# EasyEDA Pro project ProPrj_SHIGURE_2025-02-14.epro

# Schematic Schematic1
Board Name: Board1; Create Date: 2025-01-20; Page Name: P1; Project Name: SHIGURE; Schematic Name: Schematic1; Update Date: 2025-01-20; Company: 嘉立创EDA; Page Size: A4; Version: V1.0
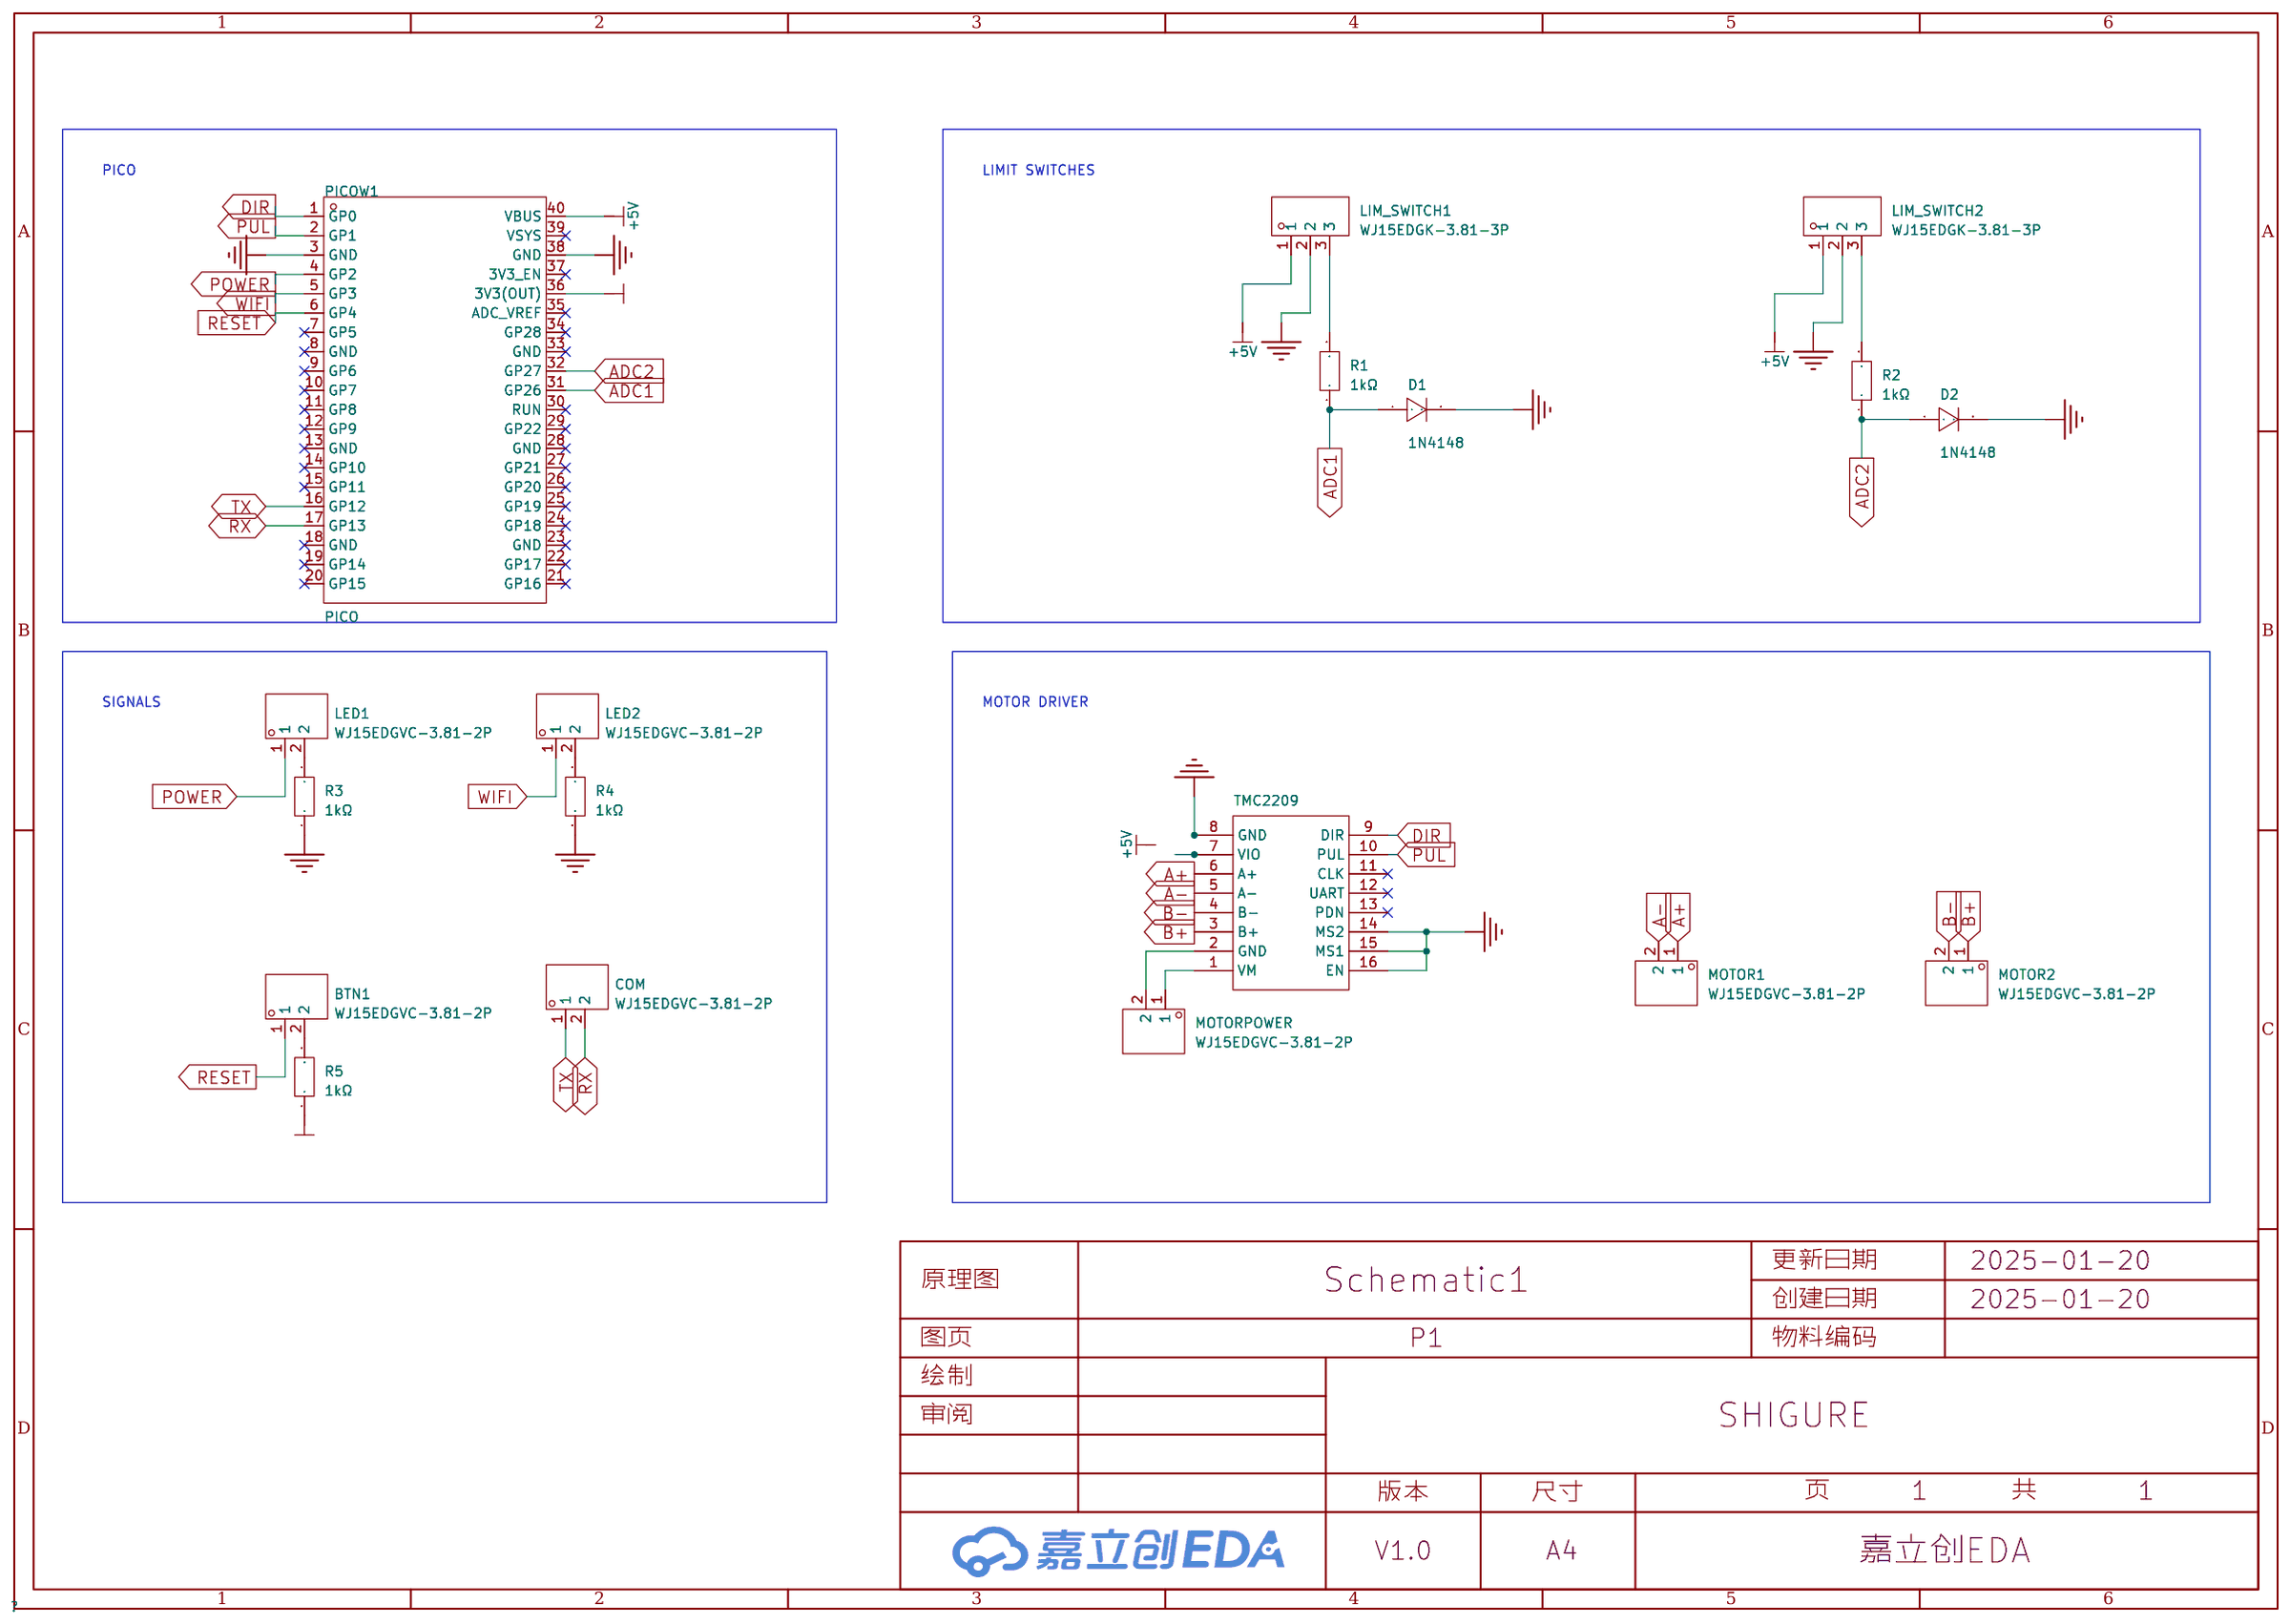
[diagram p0: schematic sheet]

## Parts
BTN1  WJ15EDGVC-3.81-2P  [CONN-TH_WJ15EDGVC-3.81-2P]
COM  WJ15EDGVC-3.81-2P  [CONN-TH_WJ15EDGVC-3.81-2P]
D1  1N4148  [DO-35_BD2.0-L4.0-P8.00-D0.5-FD]
D2  1N4148  [DO-35_BD2.0-L4.0-P8.00-D0.5-FD]
LED1  WJ15EDGVC-3.81-2P  [CONN-TH_WJ15EDGVC-3.81-2P]
LED2  WJ15EDGVC-3.81-2P  [CONN-TH_WJ15EDGVC-3.81-2P]
LIM_SWITCH1  WJ15EDGK-3.81-3P  [CONN-TH_3P-P3.81_KF2EDGV-3.81-3P]
LIM_SWITCH2  WJ15EDGK-3.81-3P  [CONN-TH_3P-P3.81_KF2EDGV-3.81-3P]
MOTOR1  WJ15EDGVC-3.81-2P  [CONN-TH_WJ15EDGVC-3.81-2P]
MOTOR2  WJ15EDGVC-3.81-2P  [CONN-TH_WJ15EDGVC-3.81-2P]
MOTORPOWER  WJ15EDGVC-3.81-2P  [CONN-TH_WJ15EDGVC-3.81-2P]
PICOW1  PICO  [PICO直插]
R1  1kΩ  [RES-TH_BD2.7-L6.2-P10.20-D0.4]
R2  1kΩ  [RES-TH_BD2.7-L6.2-P10.20-D0.4]
R3  1kΩ  [RES-TH_BD2.7-L6.2-P10.20-D0.4]
R4  1kΩ  [RES-TH_BD2.7-L6.2-P10.20-D0.4]
R5  1kΩ  [RES-TH_BD2.7-L6.2-P10.20-D0.4]
TMC2209  -  [TMC2209Module]

## Library data of the parts
BTN1 COM LED1 LED2 MOTOR1 MOTOR2 MOTORPOWER = WJ15EDGVC-3.81-2P: 连接器类型:板端/插座-闭口;固定方式:-;结构:1x2P;间距:3.81mm;颜色:-;安装方式:直针;排数:1;每排PIN数:2;额定电流:8A;额定电压:300V;线规 - AWG:-;线规 - 平方毫米:-;触头材质:黄铜;触头镀层:锡;工作温度范围:-40℃~+105℃;焊接温度(最大值):-;; LCSC Part Name: 1x2P 3.81mm 排数:1 每排P数:2; Supplier Part: C8396; Manufacturer: KANGNEX(康奈克斯电气); Supplier Footprint: 插件,P=3.81mm; JLCPCB Part Class: 扩展库; Datasheet: https://atta.szlcsc.com/upload/public/pdf/source/20191225/C8396_DFFE6D58C2AF45781C2AF0BF2B733CCC.pdf; Supplier: LCSC; Connector Type: 板端/插座-闭口; Structure: 1x2P; Pitch: 3.81mm; Mounting Style: 直针; Number of Pins: 2P; Number of Rows: 1; Number of PINs Per Row: 2; Current Rating (Max): 8A; Voltage Rating (Max): 300V; Contact Material: 黄铜; Contact Plating: 锡; Operating Temperature Range: -40℃~+105℃
D1 D2 = 1N4148_C258182: 二极管配置:-;正向压降(Vf):1V@10mA;直流反向耐压(Vr):100V;平均整流电流(Io):200mA;反向恢复时间(trr):4ns;; LCSC Part Name: 电压:100V 电流:200mA; Supplier Part: C258182; Manufacturer: onsemi(安森美); Supplier Footprint: DO-35; JLCPCB Part Class: 扩展库; Datasheet: https://atta.szlcsc.com/upload/public/pdf/source/20180829/C258182_3EE2D0AB6109C1B72B054FC50B8BC8AD.pdf; Supplier: LCSC; Forward Voltage (Vf@If): 1V@10mA; Reverse Voltage (Vr): 100V; Average Rectified Current (Io): 200mA; Reverse Leakage Current: 5uA@75V; Reverse Recovery Time (trr): 4ns; Operating Temperature: -55℃~+175℃@(Tj)
LIM_SWITCH1 LIM_SWITCH2 = WJ15EDGK-3.81-3P: 连接器类型:公插头;固定方式:-;结构:1x3P;间距:3.81mm;颜色:-;安装方式:-;排数:1;每排PIN数:3;额定电流:8A;额定电压:300V;线规 - AWG:16~28;线规 - 平方毫米:1.5;触头材质:磷青铜;触头镀层:-;工作温度范围:-40℃~+105℃;焊接温度(最大值):-;; LCSC Part Name: 1x3P 3.81mm 排数:1 每排P数:3; Supplier Part: C8413; Manufacturer: KANGNEX(康奈克斯电气); Supplier Footprint: P=3.81mm; JLCPCB Part Class: 扩展库; Datasheet: https://atta.szlcsc.com/upload/public/pdf/source/20191225/C8413_41584A983D2B58879696392C97DFEE11.pdf; Supplier: LCSC; Connector Type: 公插头; Structure: 1x3P; Pitch: 3.81mm; Number of Pins: 3P; Number of Rows: 1; Number of PINs Per Row: 3; Current Rating (Max): 8A; Voltage Rating (Max): 300V; Wire Gauge - AWG: 16~28; Wire Gauge - mm2: 1.5; Contact Material: 磷青铜; Operating Temperature Range: -40℃~+105℃; Connection Type: 螺钉连接(M2); Outlet Direction (Vertical Basis): 顶部出线
PICOW1 = PICO: "基于Raspberry Pi RP2040芯片设计；处理器：双核Arm Cortex-M0+ @ 133MHz内存：264KB片上SRAM；2MB板上QSPI闪存接口：26个GPIO引脚，包括3个模拟输入；2 × UART；2 × SPI控制器；2 × I2C控制器；16个PWM通道；1 × USB 1.1控制器和PHY，支持主机和设备；8 × PIO状态机"; Supplier Part: C7203002; Manufacturer: Raspberry Pi(树莓派); Datasheet: https://atta.szlcsc.com/upload/public/pdf/source/20230906/086376002DDC9866828648BC93E51F8B.pdf; Supplier: LCSC
R1-R5 = MF1/4W-1K±1%-ST52: 电阻类型:金属膜电阻;阻值:1kΩ;精度:±1%;功率:250mW;温度系数:±100ppm/℃;; LCSC Part Name: 金属膜电阻 1kΩ ±1% 250mW; Supplier Part: C2903245; Manufacturer: VO(翔胜); Supplier Footprint: 插件,D2.7xL6.2mm; JLCPCB Part Class: 扩展库; Datasheet: https://atta.szlcsc.com/upload/public/pdf/source/20200609/C601728_5AA4C0C8E12E11069DA2C3356F29D1F2.pdf; Supplier: LCSC; Type: 金属膜电阻; Tolerance: ±1%; Overload Voltage (Max): 250V; Power(Watts): 250mW; Temperature Coefficient: ±100ppm/℃; Operating Temperature Range: -55℃~+155℃
TMC2209 = TMC2209Module

## Nets
3V3: PICOW1.36(3V3(OUT)) R5.1
+5V: LIM_SWITCH1.1 LIM_SWITCH2.1 PICOW1.40(VBUS) TMC2209.7(VIO)
GND: D1.2(K) D2.2(K) LIM_SWITCH1.2 LIM_SWITCH2.2 PICOW1.3(GND) PICOW1.38(GND) R3.1 R4.1 TMC2209.8(GND) TMC2209.14(MS2) TMC2209.15(MS1) TMC2209.16(EN)
A+: MOTOR1.1 TMC2209.6(A+)
A-: MOTOR1.2 TMC2209.5(A-)
ADC1: D1.1(A) PICOW1.31(GP26) R1.1
ADC2: D2.1(A) PICOW1.32(GP27) R2.1
B+: MOTOR2.1 TMC2209.3(B+)
B-: MOTOR2.2 TMC2209.4(B-)
DIR: PICOW1.1(GP0) TMC2209.9(DIR)
POWER: LED1.1 PICOW1.4(GP2)
PUL: PICOW1.2(GP1) TMC2209.10(PUL)
RESET: BTN1.1 PICOW1.6(GP4)
RX: COM.2 PICOW1.17(GP13)
TX: COM.1 PICOW1.16(GP12)
WIFI: LED2.1 PICOW1.5(GP3)
$1N923: LIM_SWITCH1.3 R1.2
$1N1215: LIM_SWITCH2.3 R2.2
$1N1557: LED1.2 R3.2
$1N1596: LED2.2 R4.2
$1N2055: BTN1.2 R5.2
Net-(MOTORPOWER-1): MOTORPOWER.1 TMC2209.1(VM)
Net-(MOTORPOWER-2): MOTORPOWER.2 TMC2209.2(GND)

Not connected (* = marked no-connect by the designer): PICOW1 7(GP5)* 8(GND)* 9(GP6)* 10(GP7)* 11(GP8)* 12(GP9)* 13(GND)* 14(GP10)* 15(GP11)* 18(GND)* 19(GP14)* 20(GP15)* 21(GP16)* 22(GP17)* 23(GND)* 24(GP18)* 25(GP19)* 26(GP20)* 27(GP21)* 28(GND)* 29(GP22)* 30(RUN)* 33(GND)* 34(GP28)* 35(ADC_VREF)* 37(3V3_EN)* 39(VSYS)*; TMC2209 11(CLK)* 12(UART)* 13(PDN)*

## Notes on the sheet
- PICO
- LIMIT SWITCHES
- SIGNALS
- MOTOR DRIVER

# Board PCB1
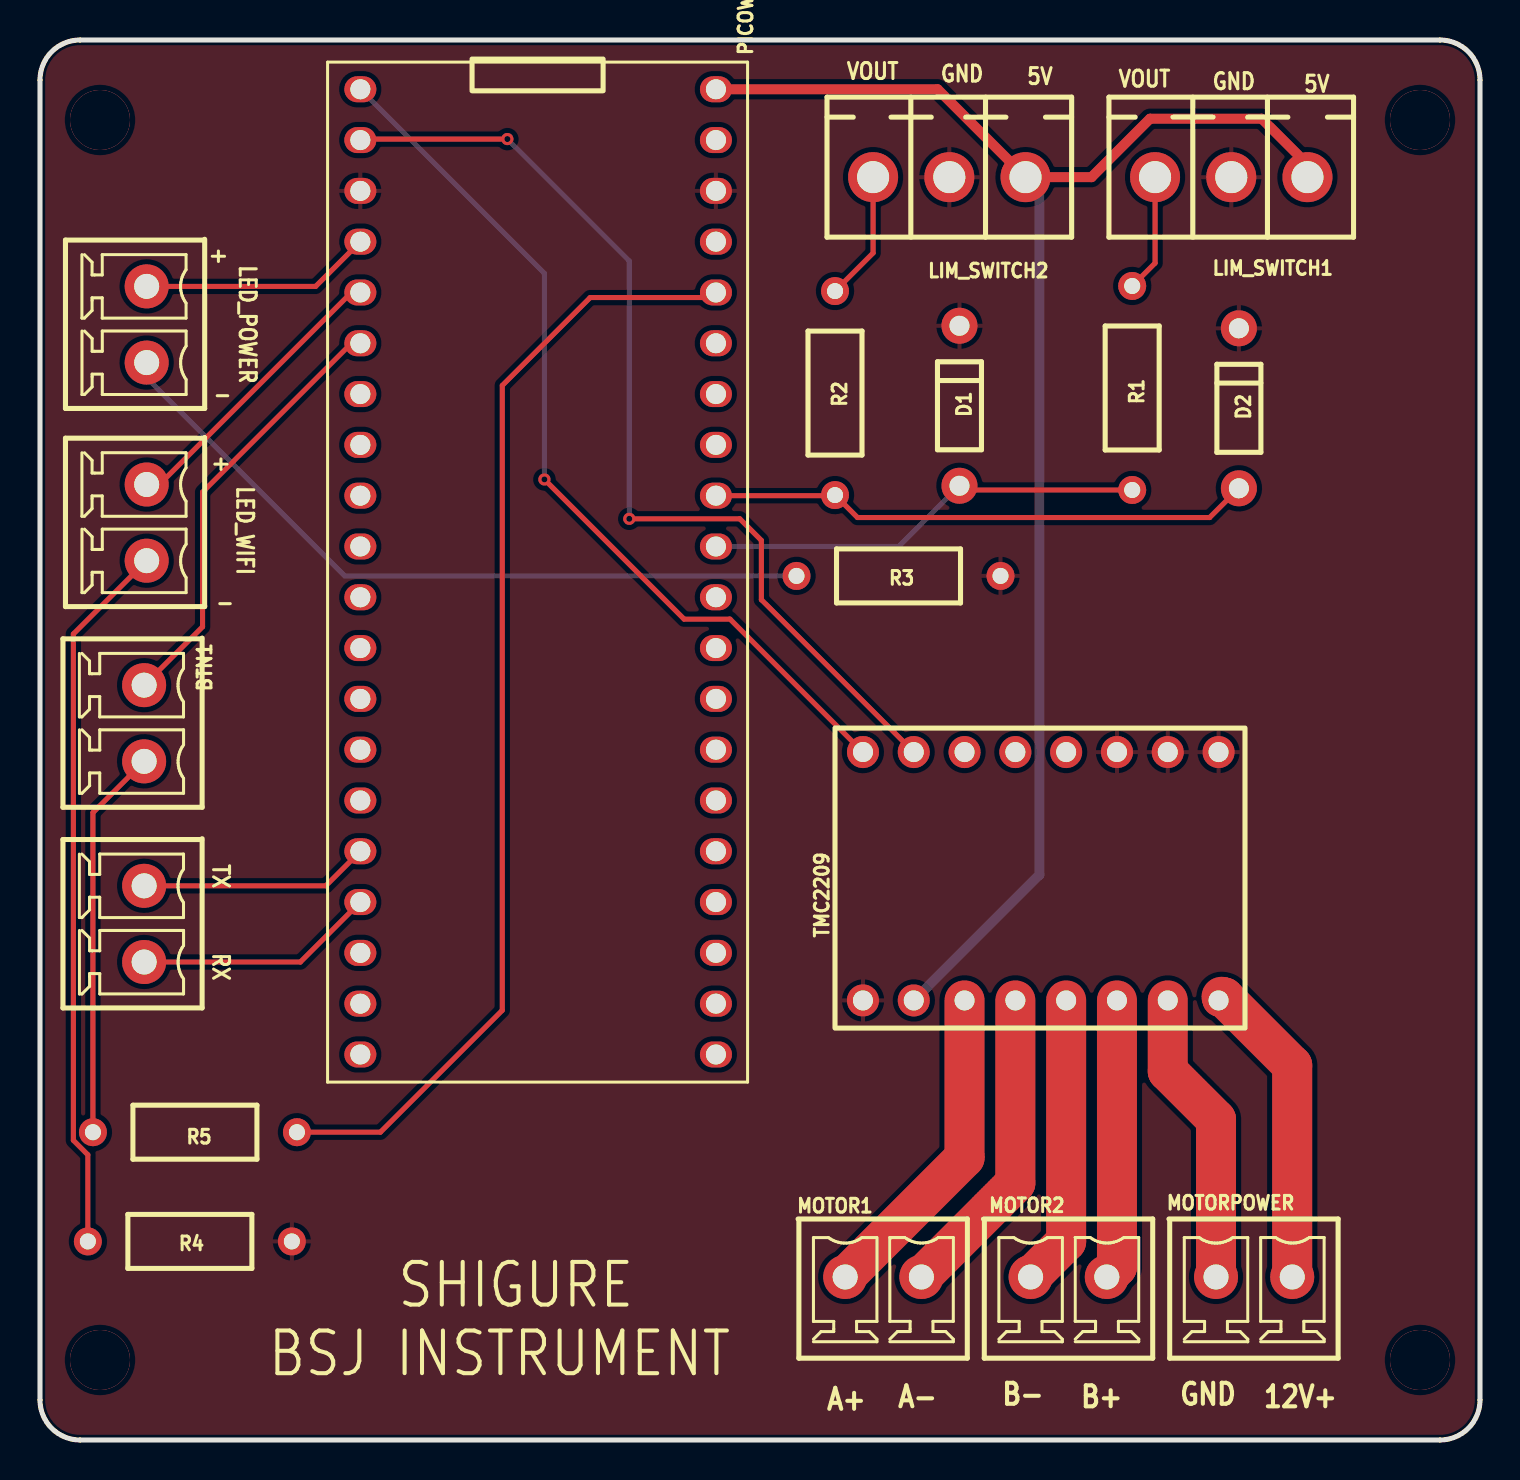
[diagram p1: board, top side]
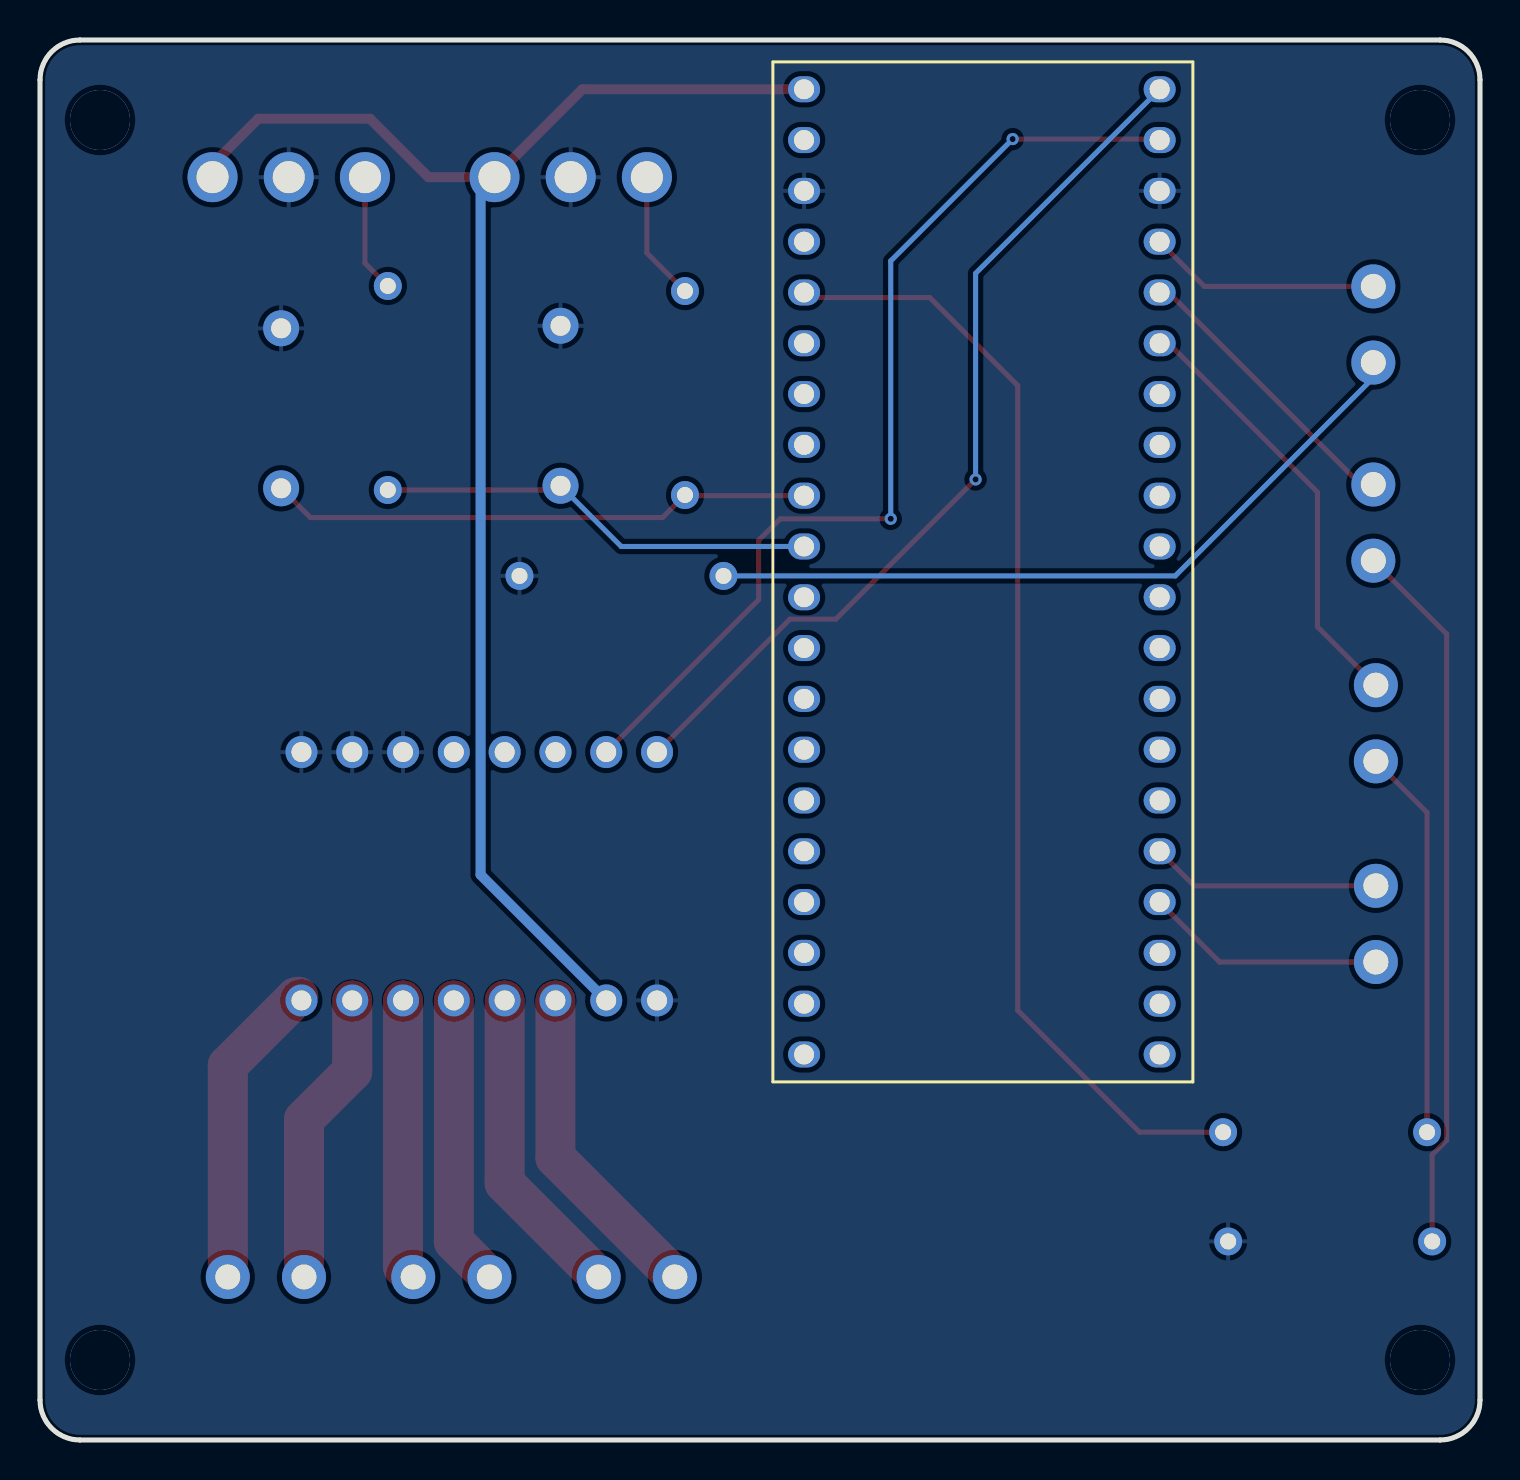
[diagram p2: board, bottom side, seen from below]

Outline 72 x 70 mm; copper layers: Top Layer, Bottom Layer. Coordinates in mm from the lower left corner of the outline.
Outline path: 0,68 0,2 arc(0.59,0.59) 2,0 70,0 arc(71.41,0.59) 72,2 72,68 arc(71.41,69.41) 70,70 2,70 arc(0.59,69.41) 0,68
Stack: Top Layer 0.035mm / Dielectric1 1.51mm FR4 er 4.5 / Bottom Layer 0.035mm

## Design rules (mm)
template: JLCPCB Capability(Two Layers Board)
spacing copperThickness1oz (default): track to track 0.102, other pairs 0.152 to 0.3
spacing copperThickness2oz: track to track 0.203, other pairs 0.152 to 0.3
track width copperThickness1oz (default): min 0.127, default 0.254, max 2.54
track width copperThickness2oz: min 0.203, default 0.254, max 2.54
differential pair differentialPair (default): width min 0.127, default 0.254, max 2.54; gap min 0.152, default 0.152
via viaSize (default): diameter min 0.5, default 0.61, max 10; hole min 0.3, default 0.305, max 6.3

## Placement (name value [footprint] x y rotation side)
BTN1  WJ15EDGVC-3.81-2P  [CONN-TH_WJ15EDGVC-3.81-2P]  5.21 35.84 270 top
COM  WJ15EDGVC-3.81-2P  [CONN-TH_WJ15EDGVC-3.81-2P]  5.21 25.8 270 top
D1  1N4148  [DO-35_BD2.0-L4.0-P8.00-D0.5-FD]  45.97 51.71 90 top
D2  1N4148  [DO-35_BD2.0-L4.0-P8.00-D0.5-FD]  59.94 51.58 90 top
LED1  WJ15EDGVC-3.81-2P  [CONN-TH_WJ15EDGVC-3.81-2P]  5.33 55.78 270 top
LED2  WJ15EDGVC-3.81-2P  [CONN-TH_WJ15EDGVC-3.81-2P]  5.33 45.87 270 top
LIM_SWITCH1  WJ15EDGK-3.81-3P  [CONN-TH_3P-P3.81_KF2EDGV-3.81-3P]  59.56 63.14 180 top
LIM_SWITCH2  WJ15EDGK-3.81-3P  [CONN-TH_3P-P3.81_KF2EDGV-3.81-3P]  45.47 63.14 180 top
MOTOR1  WJ15EDGVC-3.81-2P  [CONN-TH_WJ15EDGVC-3.81-2P]  42.16 8.15 0 top
MOTOR2  WJ15EDGVC-3.81-2P  [CONN-TH_WJ15EDGVC-3.81-2P]  51.44 8.15 0 top
MOTORPOWER  WJ15EDGVC-3.81-2P  [CONN-TH_WJ15EDGVC-3.81-2P]  60.71 8.15 0 top
PICOW1  PICO  [PICO直插]  24.76 50.7 270 top
R1  1kΩ  [RES-TH_BD2.7-L6.2-P10.20-D0.4]  54.61 52.6 90 top
R2  1kΩ  [RES-TH_BD2.7-L6.2-P10.20-D0.4]  39.75 52.35 90 top
R3  1kΩ  [RES-TH_BD2.7-L6.2-P10.20-D0.4]  42.93 43.2 180 top
R4  1kΩ  [RES-TH_BD2.7-L6.2-P10.20-D0.4]  7.49 9.93 180 top
R5  1kΩ  [RES-TH_BD2.7-L6.2-P10.20-D0.4]  7.75 15.39 180 top
TMC2209  -  [TMC2209Module]  39.75 20.6 90 top

## Footprints (pads in the part's own frame, mm; a bottom-side part is the same pattern mirrored in y, then rotated)
CONN-TH_3P-P3.81_KF2EDGV-3.81-3P
  round 2.5 hole 1.6: 1(-3.81,0) 2(0,0) 3(3.81,0)
CONN-TH_WJ15EDGVC-3.81-2P
  round 2.2 hole 1.25: 1(-1.905,0) 2(1.905,0)
DO-35_BD2.0-L4.0-P8.00-D0.5-FD
  round 1.8 hole 1: 1(-4,0) 2(4,0)
PICO直插
  oval 1.3x1.6 hole 1: 1(-16.84,-8.748) 2(-14.3,-8.748) 3(-11.76,-8.748) 4(-9.22,-8.748) 5(-6.68,-8.748) 6(-4.14,-8.748) 7(-1.6,-8.748) 8(0.94,-8.748) 9(3.48,-8.748) 10(6.02,-8.748) 11(8.56,-8.748) 12(11.1,-8.748) 13(13.64,-8.748) 14(16.18,-8.748) 15(18.72,-8.748) 16(21.26,-8.748) 17(23.8,-8.748) 18(26.34,-8.748) 19(28.88,-8.748) 20(31.42,-8.748) 21(31.42,9.032) 22(28.88,9.032) 23(26.34,9.032) 24(23.8,9.032) 25(21.26,9.032) 26(18.72,9.032) 27(16.18,9.032) 28(13.64,9.032) 29(11.1,9.032) 30(8.56,9.032) 31(6.02,9.032) 32(3.48,9.032) 33(0.94,9.032) 34(-1.6,9.032) 35(-4.14,9.032) 36(-6.68,9.032) 37(-9.22,9.032) 38(-11.76,9.032) 39(-14.3,9.032) 40(-16.84,9.032)
RES-TH_BD2.7-L6.2-P10.20-D0.4
  round 1.4 hole 0.8: 1(-5.1,0) 2(5.1,0)
TMC2209Module
  round 1.6 hole 1: 1(1.381,-19.177) 2(1.381,-16.637) 3(1.381,-14.097) 4(1.381,-11.557) 5(1.381,-9.017) 6(1.381,-6.477) 7(1.381,-3.937) 8(1.381,-1.397) 9(13.8,-1.397) 10(13.8,-3.937) 11(13.8,-6.477) 12(13.8,-9.017) 13(13.8,-11.557) 14(13.8,-14.097) 15(13.8,-16.637) 16(13.8,-19.177)

## Nets
As in the schematic, except:
B+: MOTOR2.2 TMC2209.3
B-: MOTOR2.1 TMC2209.4
$1N6364: MOTORPOWER.2 TMC2209.1
$1N6369: MOTORPOWER.1 TMC2209.2

Pads without a net: PICOW1 7 8 9 10 11 12 13 14 15 18 19 20 21 22 23 24 25 26 27 28 29 30 33 34 35 37 39; TMC2209 11 12 13

## Via types
v1: diameter 3, hole 3, Top Layer to Bottom Layer, 4 vias
v2: diameter 0.61, hole 0.305, Top Layer to Bottom Layer, 3 vias

## Routing (per net, layer and track width the routed paths; a pad name or vN(x,y) marks a point on that pad's centre or on a via; arc(x,y) is an arc through that point)
3V3: length 56.6
  Top Layer w0.254: PICOW1.36 33.54,57.12 27.51,57.12 23.11,52.73 23.11,21.49 17.02,15.39 R5.1
+5V: length 78.2
  Top Layer w0.5: LIM_SWITCH1.1 63.37,63.78 61.09,66.06 55.5,66.06 52.58,63.14 LIM_SWITCH2.1 44.88,67.54 PICOW1.40
  Bottom Layer w0.5: TMC2209.7 49.97,28.26 49.97,62.45 LIM_SWITCH2.1
(no net):
  vias: v1(3,66) v1(3,4) v1(69,66) v1(69,4)
A+: length 16.3
  Top Layer w2: TMC2209.6 46.23,14.12 MOTOR1.1
A-: length 15.8
  Top Layer w2: MOTOR1.2 48.77,12.85 TMC2209.5
ADC1: length 22.2
  Top Layer w0.254: R1.1 46.19,47.5 D1.1
  Bottom Layer w0.254: D1.1 42.94,44.68 PICOW1.31
ADC2: length 27.2
  Top Layer w0.254: D2.1 58.48,46.12 40.87,46.12 R2.1 39.72,47.22 PICOW1.32
B+: length 14
  Top Layer w2: MOTOR2.2 53.85,8.66 TMC2209.3
B-: length 14.6
  Top Layer w2: TMC2209.4 51.31,9.93 MOTOR2.1
DIR: length 44.9
  Top Layer w0.254: TMC2209.9 34.5,41.04 32.21,41.04 v2(25.22,48.03)
  Bottom Layer w0.254: PICOW1.1 25.22,58.33 v2(25.22,48.03)
POWER: length 11.6
  Top Layer w0.254: LED1.1 13.78,57.68 PICOW1.4
PUL: length 49.7
  Top Layer w0.254: v2(23.37,65.05) 16.07,65.05 PICOW1.2 ; v2(29.46,46.06) 34.99,46.06 36.07,44.98 36.07,42.02 TMC2209.10
  Bottom Layer w0.254: v2(29.46,46.06) 29.46,58.95 v2(23.37,65.05)
RESET: length 21.8
  Top Layer w0.254: BTN1.1 8.13,40.66 8.13,47.39 15.57,54.84 PICOW1.6
RX: length 12.1
  Top Layer w0.254: COM.2 13.02,23.9 PICOW1.17
TX: length 11.5
  Top Layer w0.254: COM.1 14.29,27.71 PICOW1.16
WIFI: length 14.7
  Top Layer w0.254: LED2.1 5.97,47.78 15.57,57.38 PICOW1.5
$1N923: length 5.9
  Top Layer w0.254: LIM_SWITCH1.3 55.75,58.84 R1.2
$1N1215: length 6.5
  Top Layer w0.254: LIM_SWITCH2.3 41.66,59.35 39.75,57.45
$1N1557: length 37.4
  Bottom Layer w0.254: LED1.2 5.33,53.11 15.24,43.2 R3.2
$1N1596: length 35.9
  Top Layer w0.254: LED2.2 1.67,40.3 1.67,14.98 2.39,14.26 R4.2
$1N2055: length 19.6
  Top Layer w0.254: R5.2 2.65,31.37 BTN1.2
$1N6364: length 15.5
  Top Layer w2: MOTORPOWER.2 62.61,18.73 59.21,22.13 59.11,22.13 59.08,22.16
$1N6369: length 14.8
  Top Layer w2: TMC2209.2 56.39,18.44 58.8,16.03 MOTORPOWER.1

## Copper pours and planes (outline as drawn; the poured copper is in the pictures)
GND on Top Layer: -5.97,76.22 76.45,76.22 76.45,-5.56 -5.97,-5.56
GND on Bottom Layer: -5.97,76.6 75.44,76.6 75.44,-4.68 -5.97,-4.68

## Text on the board
Top Silkscreen Layer: VOUT | GND | 5V | + | TX | RX | LED_WIFI | LED_POWER | - | A+ | A- | B- | B+ | 12V+ | BSJ INSTRUMENT | SHIGURE
